# EAGLE design RJ11-ICSP-Breakout (EAGLE 7.5.0)
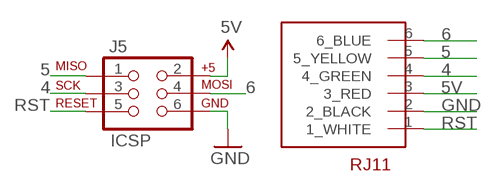
[diagram p0: schematic, sheet 1]

## Parts
J5  ICSP  AVR_SPI_PRG_6LABELED  [2X3-NS]
U$7  RJ12  [RJ12]

## Nets
4: J5.3(SCK) U$7.4(4_GREEN)
5: J5.1(MISO) U$7.5(5_YELLOW)
5V: J5.2(V+) U$7.3(3_RED)
6: J5.4(MOSI) U$7.6(6_BLUE)
GND: J5.6(GND) U$7.2(2_BLACK)
RST: J5.5(RST) U$7.1(1_WHITE)

## Library data of the parts
J5 = barbary_enterprises:AVR_SPI_PRG_6: AVR ISP 6 Pin This is the reduced ISP connector for AVR programming. Common on Arduino. This footprint will take up less PCB space and can be used with a 10-pin to 6-pin adapter such as SKU: BOB-08508
U$7 = barbary_enterprises:RJ12

## Board
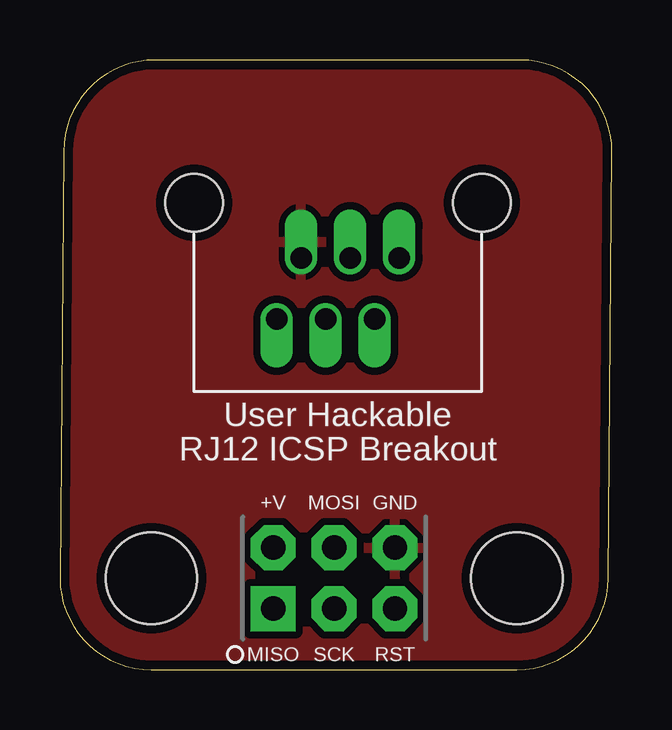
[diagram p1: board, top side]
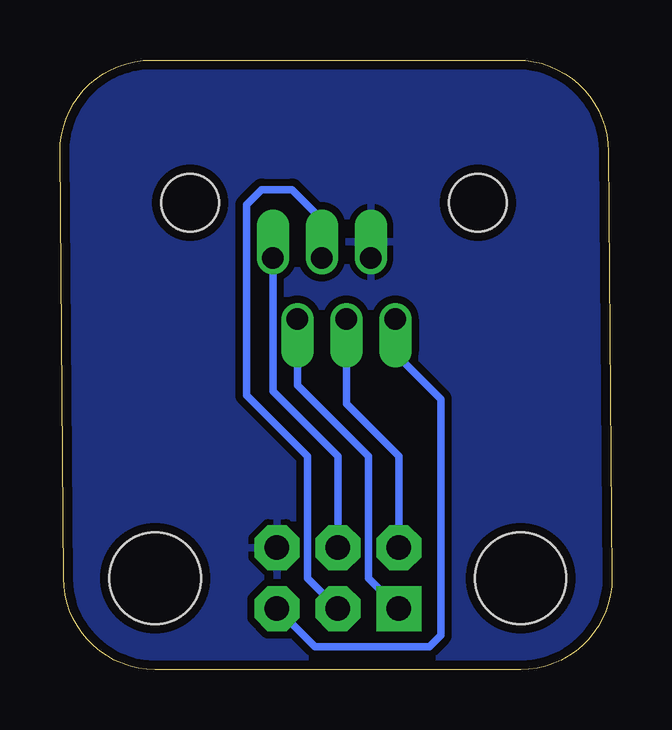
[diagram p2: board, bottom side, seen from below]

Size 23.02 x 25.4 mm. Coordinates in mm from the lower left corner, seen from the top.
Outline: 3.81,0 19.05,0 arc90 22.86,3.81 23.02,21.58 arc90 19.2,25.4 3.97,25.4 arc90 0.16,21.59 0,3.81 arc90 3.81,0
Copper layers (1*16): Top 0.0356mm / dielectric 1.5011mm / Bottom 0.0356mm
Design rules "LaenPCBOrder": minimum track width 6mil, minimum drill 13mil, track to track 6mil, track to pad 6mil, pad to pad 6mil, via to via 6mil, smd to smd 6mil, copper to edge 15mil, drill to drill 6mil, minimum pad ring 7mil, minimum via ring 7mil, stop-mask expansion 3mil, vias tented up to drill 0mil, thermal gap 10mil
Holes 3.81 mm at 3.81,3.81 19.05,3.81

### Footprints (pad centres in the part's own frame; a part is rotated, then mirrored left to right if it is on the bottom)
2X3-NS = drill 1.016 pad 1.88 square: 1 -2.54,-1.27 | drill 1.016 pad 1.88 octagon: 2 -2.54,1.27; 3 0,-1.27; 4 0,1.27; 5 2.54,-1.27; 6 2.54,1.27
RJ12 = drill 0.9 offset: 1 2.55,2.54; 2 1.53,0; 3 0.51,2.54; 4 -0.51,0; 5 -1.53,2.54; 6 -2.55,0 | hole 2.4: 6,-2.3; -6,-2.3

### Placement (x,y rotation side)
J5  11.43,3.81 0 top
U$7  11.59,17.14 180 top

### Tracks (layer width: path | path; a pad name or v marks a point on that pad's centre or on a via)
4
  Bottom 0.305: J5.3 12.7,3.81 12.7,8.89 15.24,11.43 15.24,19.37 14.61,20 13.34,20 12.06,18.73 12.06,17.18 U$7.4
5
  Bottom 0.305: J5.1 10.16,3.81 10.16,8.89 13.12,11.85 U$7.5
5V
  Bottom 0.305: J5.2 8.89,8.89 11.08,11.08 U$7.3
6
  Bottom 0.305: J5.4 11.43,8.89 14.14,11.6 U$7.6
GND
  pour Top (isolate 0.305): 19.2,25.4 3.98,25.4 arc90 0.16,21.58 0,3.86 arc90 3.86,0 19.05,0 arc90 22.86,3.81 23.02,21.58 arc90
  pour Bottom (isolate 0.305): 0,0 22.86,0 23.02,25.4 0.16,25.4
RST
  Bottom 0.305: J5.5 12.38,0.95 7.62,0.95 7.14,1.43 7.14,11.27 9.05,13.18 9.05,14.6 U$7.1

### Text on the board
tPlace: User Hackable | RJ12 ICSP Breakout